# Altium schematic sheet 09 ETHERNET_ENET.SchDoc
size 513 x 386 mm
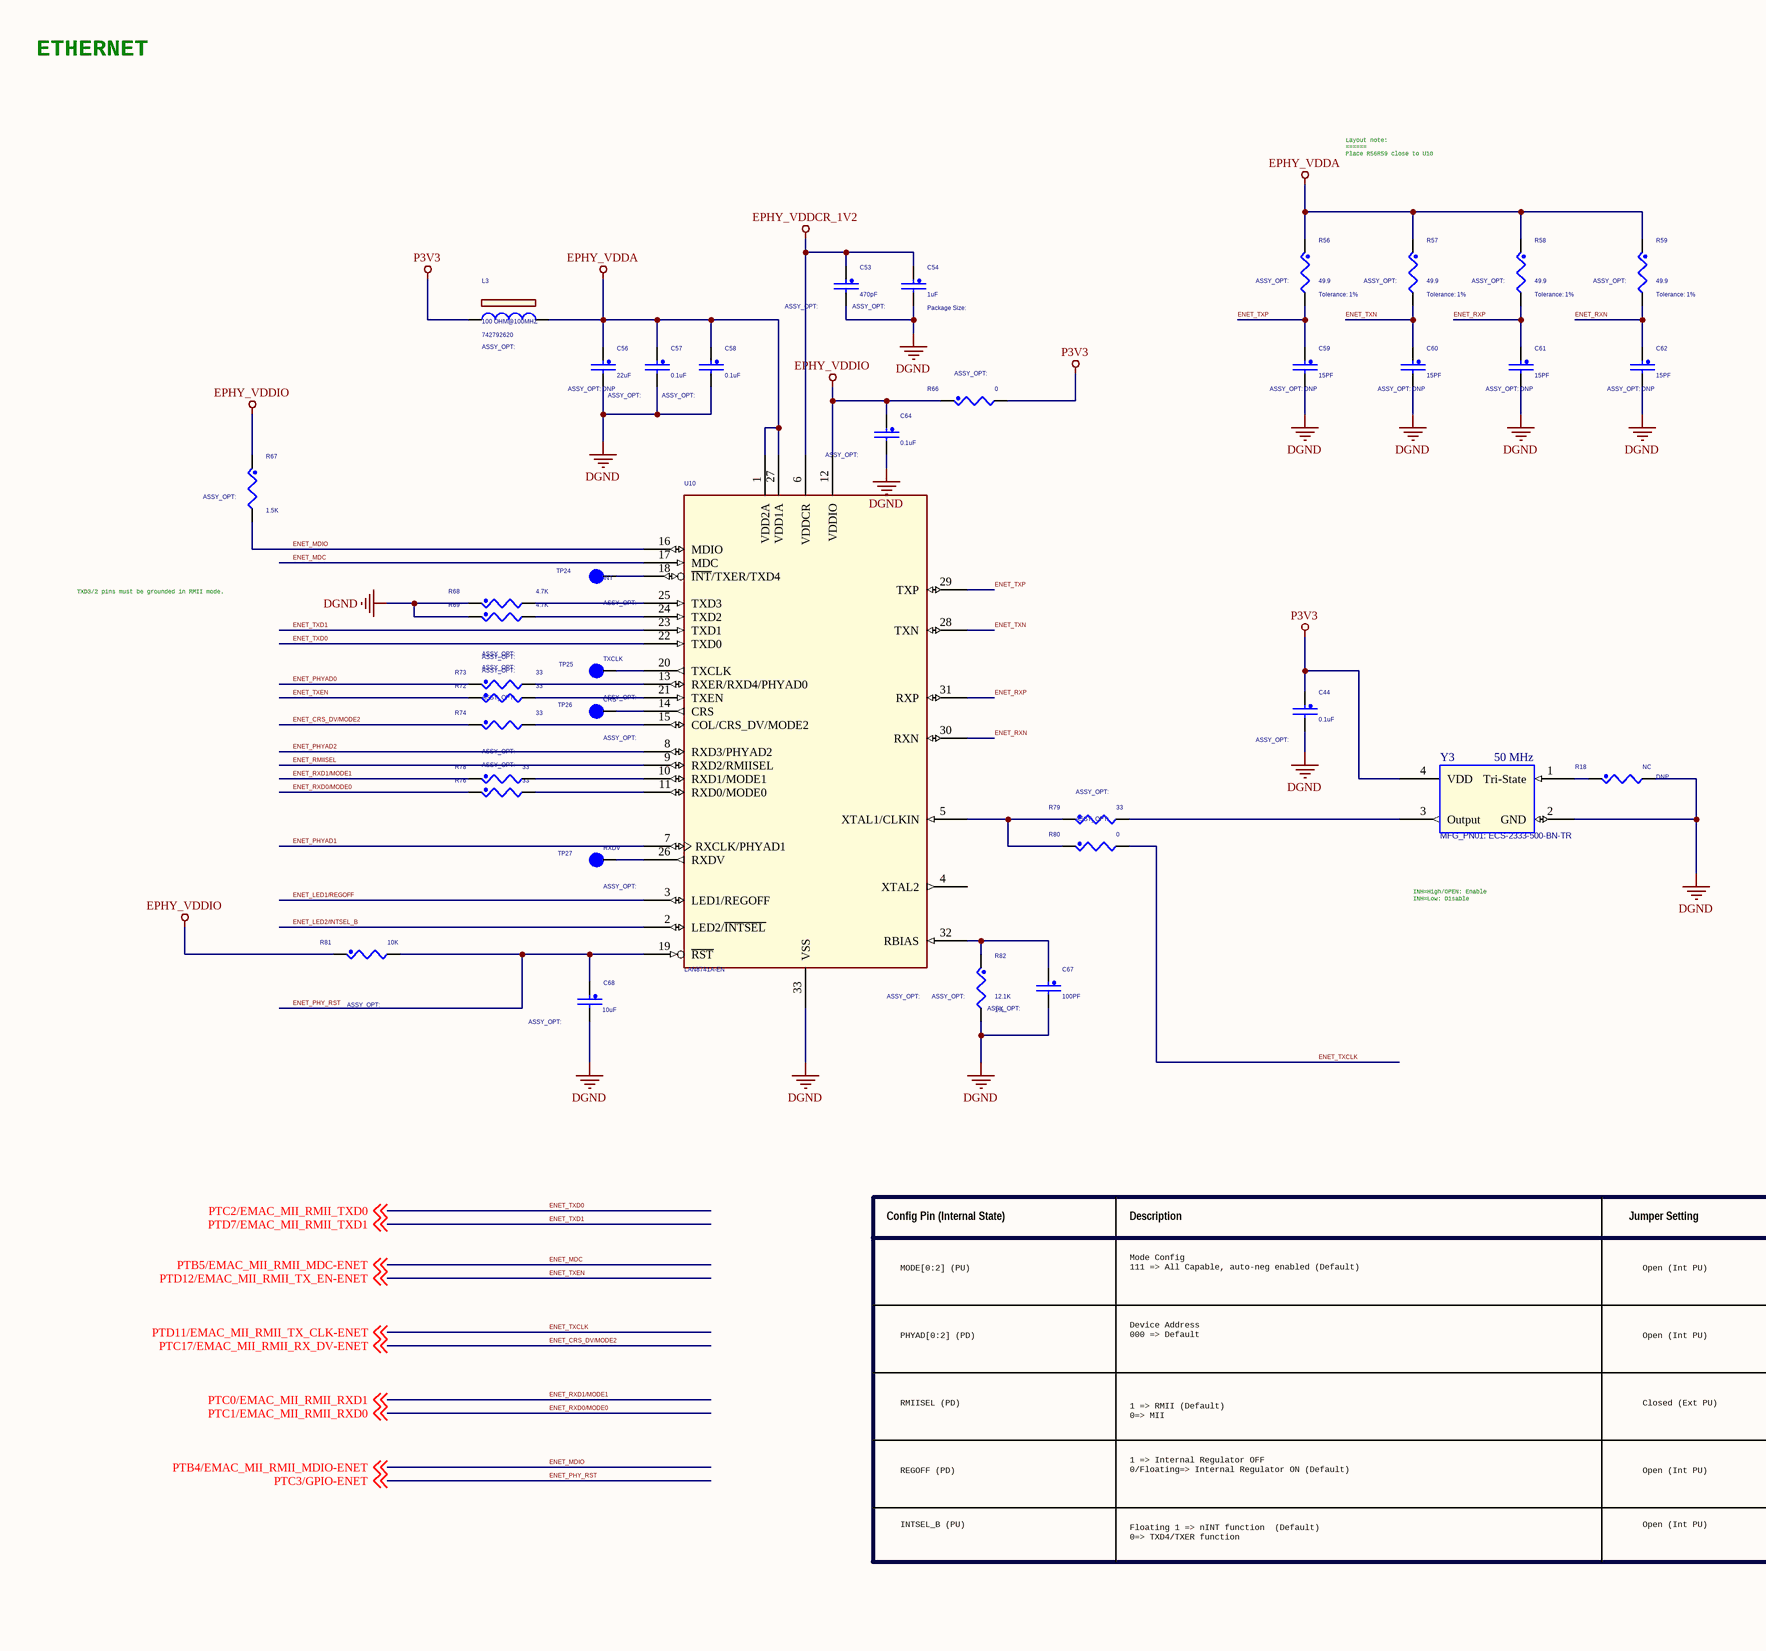
[diagram p0: 09 ETHERNET_ENET.SchDoc, left]
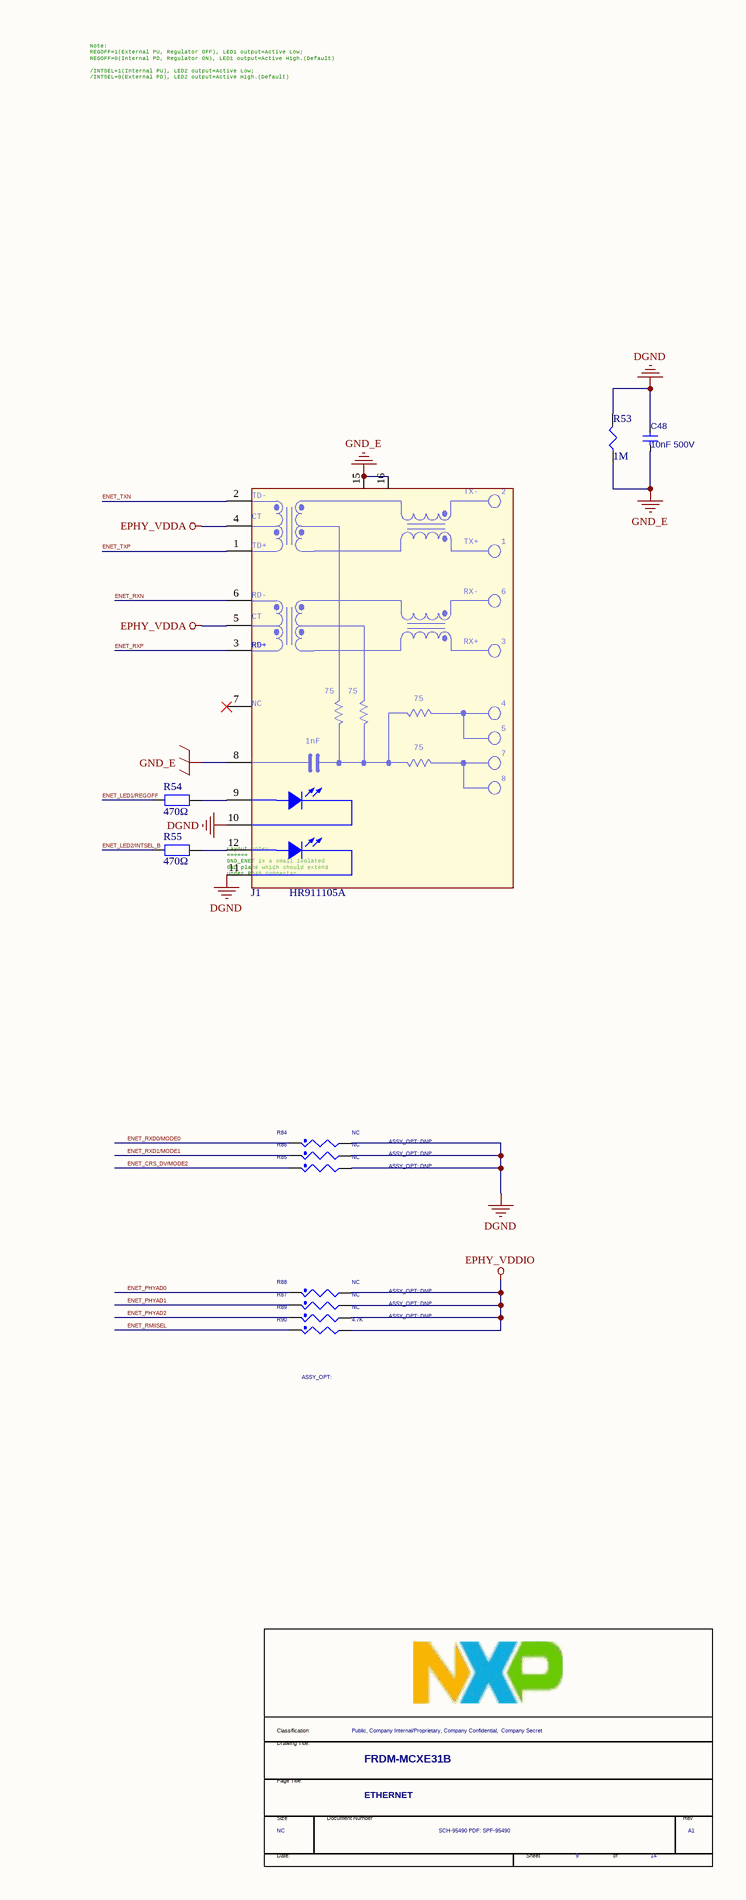
[diagram p1: 09 ETHERNET_ENET.SchDoc, right]

## Parts
*  Title: FRDM-MCXE31B  RevCode: A1  PageTitle: ETHERNET  Page Size: NC  Page Number: 9  Page Count: 14  Doc: SCH-95490 PDF: SPF-95490  Classification: Public, Company Internal/Proprietary, Company Confidential,  Company Secret  (hidden comment: TitleBlock_FS)  (graphical)
C44  0.1uF  [CC0402_25]
C48  10nF 500V  [1210]
C53  470pF  [CC0402_25]
C54  1uF  [CC0402_25]
C56  22uF  ASSY_OPT: DNP  [CC0603_OV]
C57  0.1uF  [CC0402_25]
C58  0.1uF  [CC0402_25]
C59  15PF  ASSY_OPT: DNP  [CC0402_25]
C60  15PF  ASSY_OPT: DNP  [CC0402_25]
C61  15PF  ASSY_OPT: DNP  [CC0402_25]
C62  15PF  ASSY_OPT: DNP  [CC0402_25]
C64  0.1uF  [CC0402_25]
C67  100PF  [CC0402_25]
C68  10uF  [CC0402_25]
J1  HR911105A  [RJ45-HR911105A]
L3  100 OHM@100MHZ  MFG_PN01: 742792620  [L 0603_L]
R18  NC  ASSY_OPT: DNP  [RC0402_25]
R53  1M  [1210]
R54  470Ω  [R0603]
R55  470Ω  [R0603]
R56  49.9  Tolerance: 1%  [RC0402_25]
R57  49.9  Tolerance: 1%  [RC0402_25]
R58  49.9  Tolerance: 1%  [RC0402_25]
R59  49.9  Tolerance: 1%  [RC0402_25]
R66  0  [RC0603_OV]
R67  1.5K  [RC0402_25]
R68  4.7K  [RC0402_25]
R69  4.7K  [RC0402_25]
R72  33  [RC0402_25]
R73  33  [RC0402_25]
R74  33  [RC0402_25]
R76  33  [RC0402_25]
R78  33  [RC0402_25]
R79  33  [RC0402_25]
R80  0  [RC0402_25]
R81  10K  [RC0402_25]
R82  12.1K  Tolerance: 1%  [RC0402_25]
R84  NC  ASSY_OPT: DNP  [RC0402_25]
R85  NC  ASSY_OPT: DNP  [RC0402_25]
R86  NC  ASSY_OPT: DNP  [RC0402_25]
R87  NC  ASSY_OPT: DNP  [RC0402_25]
R88  NC  ASSY_OPT: DNP  [RC0402_25]
R89  NC  ASSY_OPT: DNP  [RC0402_25]
R90  4.7K  [RC0402_25]
TP24  SILK: INT  [TPAD_030]  (hidden comment: TPAD_030)
TP25  SILK: TXCLK  [TPAD_030]  (hidden comment: TPAD_030)
TP26  SILK: CRS  [TPAD_030]  (hidden comment: TPAD_030)
TP27  SILK: RXDV  [TPAD_030]  (hidden comment: TPAD_030)
U10  LAN8741A-EN  [QFN-32-EP(5x5)]
Y3  50 MHz  MFG_PN01: ECS-2333-500-BN-TR  [OSC-SMD_4P-L3.2-W2.5-BL]

## Nets
DGND: C44.2 C48.2 C53.2 C54.2 C56.2 C57.2 C58.2 C59.2 C60.2 C61.2 C62.2 C64.2 C67.2 C68.2 J1.10(CATHODE) J1.11(CATHODE) R18.2 R53.2 R68.1 R69.1 R82.2 R84.2 R85.2 R86.2 U10.33(VSS) Y3.2(GND)
EPHY_VDDA: C56.1 C57.1 C58.1 J1.4(P4) J1.5(P5) L3.2 R56.1 R57.1 R58.1 R59.1 U10.1(VDD2A) U10.27(VDD1A)
EPHY_VDDCR_1V2: C53.1 C54.1 U10.6(VDDCR)
EPHY_VDDIO: C64.1 R66.1 R67.1 R81.1 R87.2 R88.2 R89.2 R90.2 U10.12(VDDIO)
GND_E: C48.1 J1.8(P8) J1.15(P15) J1.16(P16) R53.1
P3V3: C44.1 L3.1 R66.2 Y3.4(VDD)
ENET_CRS_DV/MODE2: R74.1 R85.1 ; off-sheet PTC17/EMAC_MII_RMII_RX_DV-ENET  [also labelled PTC17/EMAC_MII_RMII_RX_DV-ENET]
ENET_LED1/REGOFF: R54.2 U10.3(LED1/REGOFF)
ENET_LED2/INTSEL_B: R55.2 U10.2(LED2/~{INTSEL})
ENET_MDC: U10.17(MDC) ; off-sheet PTB5/EMAC_MII_RMII_MDC-ENET  [also labelled PTB5/EMAC_MII_RMII_MDC-ENET]
ENET_MDIO: R67.2 U10.16(MDIO) ; off-sheet PTB4/EMAC_MII_RMII_MDIO-ENET  [also labelled PTB4/EMAC_MII_RMII_MDIO-ENET]
ENET_PHY_RST: C68.1 R81.2 U10.19(~{RST}) ; off-sheet PTC3/GPIO-ENET  [also labelled PTC3/GPIO-ENET]
ENET_PHYAD0: R73.1 R88.1
ENET_PHYAD1: R87.1 U10.7(RXCLK/PHYAD1)
ENET_PHYAD2: R89.1 U10.8(RXD3/PHYAD2)
ENET_RMIISEL: R90.1 U10.9(RXD2/RMIISEL)
ENET_RXD0/MODE0: R76.1 R84.1 ; off-sheet PTC1/EMAC_MII_RMII_RXD0  [also labelled PTC1/EMAC_MII_RMII_RXD0]
ENET_RXD1/MODE1: R78.1 R86.1 ; off-sheet PTC0/EMAC_MII_RMII_RXD1  [also labelled PTC0/EMAC_MII_RMII_RXD1]
ENET_RXN: C62.1 J1.6(P6) R59.2 U10.30(RXN)
ENET_RXP: C61.1 J1.3(P3) R58.2 U10.31(RXP)
ENET_TXCLK: R80.2 ; off-sheet PTD11/EMAC_MII_RMII_TX_CLK-ENET  [also labelled PTD11/EMAC_MII_RMII_TX_CLK-ENET]
ENET_TXD0: U10.22(TXD0) ; off-sheet PTC2/EMAC_MII_RMII_TXD0  [also labelled PTC2/EMAC_MII_RMII_TXD0]
ENET_TXD1: U10.23(TXD1) ; off-sheet PTD7/EMAC_MII_RMII_TXD1  [also labelled PTD7/EMAC_MII_RMII_TXD1]
ENET_TXEN: R72.1 ; off-sheet PTD12/EMAC_MII_RMII_TX_EN-ENET  [also labelled PTD12/EMAC_MII_RMII_TX_EN-ENET]
ENET_TXN: C60.1 J1.2(P2) R57.2 U10.28(TXN)
ENET_TXP: C59.1 J1.1(P1) R56.2 U10.29(TXP)
NetC67_1: C67.1 R82.1 U10.32(RBIAS)
NetJ1_9: J1.9(ANODE) R54.1
NetJ1_12: J1.12(ANODE) R55.1
NetR18_1: R18.1 Y3.1(Tri-State)
NetR68_2: R68.2 U10.25(TXD3)
NetR69_2: R69.2 U10.24(TXD2)
NetR72_2: R72.2 U10.21(TXEN)
NetR73_2: R73.2 U10.13(RXER/RXD4/PHYAD0)
NetR74_2: R74.2 U10.15(COL/CRS_DV/MODE2)
NetR76_2: R76.2 U10.11(RXD0/MODE0)
NetR78_2: R78.2 U10.10(RXD1/MODE1)
NetR79_1: R79.1 R80.1 U10.5(XTAL1/CLKIN)
NetR79_2: R79.2 Y3.3(Output)
NetTP24_1: TP24.1(Pin1) U10.18(~{INT}/TXER/TXD4)
NetTP25_1: TP25.1(Pin1) U10.20(TXCLK)
NetTP26_1: TP26.1(Pin1) U10.14(CRS)
NetTP27_1: TP27.1(Pin1) U10.26(RXDV)

Not connected (* = marked no-connect by the designer): J1 7(P7)*; U10 4(XTAL2)

## Notes on the sheet
- ETHERNET
- Layout note:
  ======
  Place R56R59 close to U10
- Note:
  REGOFF=1(External PU, Regulator OFF), LED1 output=Active Low;
  REGOFF=0(Internal PD, Regulator ON), LED1 output=Active High.(Default)
  /INTSEL=1(Internal PU), LED2 output=Active Low;
  /INTSEL=0(External PD), LED2 output=Active High.(Default)
- TXD3/2 pins must be grounded in RMII mode.
- INH=High/OPEN: Enable
  INH=Low: Disable
- (near J1) Layout note:
  ======
  GND_ENET is a small isolated
  GND plane which should extend
  under RJ45 connector
- Config Pin (Internal State)
- Description
- Jumper Setting
- MODE[0:2] (PU)
- Mode Config
  111 => All Capable, auto-neg enabled (Default)
- Open (Int PU)
- PHYAD[0:2] (PD)
- Device Address
  000 => Default
- RMIISEL (PD)
- 1 => RMII (Default)
  0=> MII
- Closed (Ext PU)
- REGOFF (PD)
- 1 => Internal Regulator OFF
  0/Floating=> Internal Regulator ON (Default)
- INTSEL_B (PU)
- Floating 1 => nINT function  (Default)
  0=> TXD4/TXER function
- (in symbol HR911105A) TX-; TD-; CT; TX+; TD+; RX-; RD-; RX+; RD+; 75; NC; 1nF
- (in symbol TitleBlock_FS) Classification:; Drawing Title:; Page Title:; Size; Document Number; Rev; Date:; Sheet; of

## Library data of the parts
* = TitleBlock_FS: Variant Name: <Core Design>; OrgAddr2: Austin, TX 78735-8598; OrgAddr1: 6501 William Cannon Drive West; OrgName: NXP Semiconductors; Classification: Company Internal/Proprietary; Page Create Date: March  8, 1995
C44 C57 C58 C64 = CAP_NP: CAP CER 0.1UF 16V 10% X7R 0402; CLASS: DISCRETE; Temp Range: -55C to +125C; SIGNAL_MODEL: DEFAULT_CAPACITOR_100000pF_2_1; AGILE_PN: 150-75182; MFG_NAME01: Samsung Electro-Mechanics; MFG_PN01: CL05B104KO5NNNC; CAD_APPROVED: Yes; FPLIST: CC0402_25,CC0402_HD,0402_CC,CAPC0402_L,cc0402_lamp3; Temp_Range: -55癈 to +85癈; 3D_Mechanical_Footprint_File: http://fcl.am.freescale.net/ALLEGRO/step/cc0402_25.STEP; Rated Voltage: 16V; Tolerance: 10%; ROHS: NULL; HEIGHT: 0.635mm; TOL: 10%; VOLTAGE: 16V
C48 = CAP
C53 = CAP_NP: CAP CER 470pF 50V 5% C0G 0402; CLASS: DISCRETE; AGILE_PN: 150-30004; FPLIST: CC0402_25,CC0402_HD,0402_CC,capc0402_l; CAD_APPROVED: YES; Temp Range: -55C to +125C; MFG_NAME01: MURATA; MFG_PN01: GRM1555C1H471JA01D; Package Size: 0402; HEIGHT: 0.55; Tolerance: 5%; Rated Voltage: 50V; ROHS: NULL
C54 = CAP_NP: CAP CER 1.0uF 16V 10% X6S 0402; CLASS: DISCRETE; MFG_PN01: GRM155C81C105KE11D; MFG_NAME01: MURATA; Temp Range: -55C to +105C; CAD_APPROVED: Yes; FPLIST: CC0402_25,CC0402_HD,0402_CC,capc0402_l; AGILE_PN: 150-80262; VOLTAGE: 16V; ROHS: Yes; Rated Voltage: 16V; Tolerance: 10%; HEIGHT: 0.55
C56 = CAP_NP: CAP CER 22uF 10V 20% X5R 0603; CLASS: DISCRETE; AGILE_PN: 150-79530; FPLIST: CC0603_OV,CC0603,0603_cc_tol; CAD_APPROVED: Yes; Temp Range: -55°C to 85°C; MFG_NAME01: SAMSUNG; MFG_PN01: CL10A226MP7LUNC; Package Size: 0603 [1608 Metric]; HEIGHT: 1.05mm; Package Type: SMD/SMT; Tolerance: 20%; Rated Voltage: 10V; ROHS: NULL; 3D_Mechanical_Footprint_File: http://fcl.am.freescale.net/ALLEGRO/step/cc0603_ov.STEP
C59-C62 = CAP_NP: CAP CER 15pF 50V 5% C0G 0402; CLASS: DISCRETE; AGILE_PN: 150-81667; FPLIST: CC0402_25,CC0402_HD,0402_CC,capc0402_l; CAD_APPROVED: Yes; Temp Range: -55°C ~ 125°C; MFG_NAME01: Murata Electronics; MFG_PN01: GJM1555C1H150JB01D; Package Size: 0402 (1005 Metric); HEIGHT: 0.55; Package Type: Surface Mount, MLCC; Tolerance: 5%; Rated Voltage: 50V; ROHS: Yes; 3D_Mechanical_Footprint_File: http://fcl.am.freescale.net/ALLEGRO/step/cc0402_25.STEP
C67 = CAP_NP: CAP CER 100pF 16V 10% X7R 0402; CLASS: DISCRETE; MFG_PN01: 0402YC101KAT2A; MFG_NAME01: AVX; Temp Range: -55C to +125C; CAD_APPROVED: Yes; FPLIST: CC0402_25,CC0402_HD,0402_CC,capc0402_l; AGILE_PN: 150-79188; ROHS: Yes; Rated Voltage: 16V; Tolerance: 10%; Package Type: 7" Reel; HEIGHT: 0.56; Package Size: 0402
C68 = CAP_NP: CAP CER 10uF 25V 20% X5R 0603; CLASS: DISCRETE; AGILE_PN: 150-79272; CAD_APPROVED: Yes; Temp Range: -55C to +85C; MFG_NAME01: MURATA; MFG_PN01: GRM188R61E106MA73D; FPLIST: CC0603_OV,CC0603,0603_cc_tol; Package Size: 0603; HEIGHT: 1; Tolerance: 20%; Rated Voltage: 25V; ROHS: Yes
J1 = HR911105A: REF: J00-0061NL; DESIG: 10/100 base TX LXT971A; BOI: RJ45; FAB: PULSE; DEV: CON_PULSE_J00-61; RoHS: YES; VAL: J00-0061NL
L3 = INDUCTOR_FERRITE: IND FER BEAD 100 OHM@100MHz 0.5A 25% AEC-Q200 0603; CLASS: DISCRETE; AGILE_PN: 180-10207; CAD_APPROVED: Yes; Temp Range: -55°C to 125°C; MFG_NAME01: WURTH ELEKTRONIK EISOS GMBH & CO. KG (ELECTRONIC & ELECTROMEHANICAL COMP); Package Size: 0603; HEIGHT: 1mm; ROHS: NULL; 3D_Mechanical_Footprint_File: http://fcl.am.freescale.net/ALLEGRO/step/ind_1p8x1mm_sm.step
R18 R80 = RES: RES MF ZERO OHM 1/10W -- 0603; CLASS: DISCRETE; AGILE_PN: 470-80866; FPLIST: RC0603_OV,RC0603,R603-X2,r603-x2_b,0603_CC,IND_0603HP_NSP,CC0603_OV_NSP; CAD_APPROVED: Yes; Temp Range: –55 °C to +155 °C; MFG_NAME01: VISHAY; MFG_PN01: CRCW06030000Z0EAC; HEIGHT: 0.6; ROHS: NULL
R53 = R
R54 R55 = R: 贴片电阻; 版权归属: 源创客; BOM名称: 贴片电阻; 学习资源: www.ooocke.com
R56-R59 = RES: RES MF 49.9 OHM 1/16W 1% 0402; CLASS: DISCRETE; MFG_PN01: CR0402-FX-49R9GLF; MFG_NAME01: BOURNS; CAD_APPROVED: Yes; FPLIST: RC0402_25,RC0402_HD,0402_CC; AGILE_PN: 470-75360; ROHS: Yes; HEIGHT: 0.4
R66 = RES: RES MF ZERO OHM 1/10W -- 0603; CLASS: DISCRETE; MFG_PN01: CRCW06030000Z0EAC; MFG_NAME01: VISHAY; Temp Range: –55 °C to +155 °C; CAD_APPROVED: Yes; FPLIST: RC0603_OV,RC0603,R603-X2,r603-x2_b,0603_CC,IND_0603HP_NSP,CC0603_OV_NSP; AGILE_PN: 470-80866; ROHS: NULL; HEIGHT: 0.6
R67 = RES: RES MF 1.5K 1/16W 1% 0402; CLASS: DISCRETE; MFG_PN01: CR0402-FX-1501GLF; MFG_NAME01: BOURNS; CAD_APPROVED: Yes; FPLIST: RC0402_25,RC0402_HD,0402_CC; AGILE_PN: 470-80487; ROHS: Yes; Tolerance: 1%; HEIGHT: 0.4
R68 R86 R87 R89 = RES: RES MF 4.7K 1/16W 5% 0402; CLASS: DISCRETE; Pkg: 0402; AGILE_PN: 470-75626; FPLIST: RC0402_25,RC0402_HD,0402_CC,RC0402_X2; CAD_APPROVED: Yes; MFG_NAME01: BOURNS; MFG_PN01: CR0402-JW-472GLF; HEIGHT: 0.41; Tolerance: 5%; ROHS: NULL
R69 R84 R85 R88 R90 = RES: RES MF 4.7K 1/16W 5% 0402; CLASS: DISCRETE; MFG_PN01: CR0402-JW-472GLF; MFG_NAME01: BOURNS; CAD_APPROVED: Yes; FPLIST: RC0402_25,RC0402_HD,0402_CC,RC0402_X2; AGILE_PN: 470-75626; Pkg: 0402; ROHS: NULL; Tolerance: 5%; HEIGHT: 0.41
R72 R76 R79 = RES: RES MF 33.0 OHM 1/16W 1% 0402; CLASS: DISCRETE; MFG_PN01: CRCW040233R0FKEDC; MFG_NAME01: VISHAY; CAD_APPROVED: Yes; FPLIST: RC0402_25,RC0402_HD,RC0402_X2,0402_CC; AGILE_PN: 470-75790; ROHS: Yes; Tolerance: 1%; HEIGHT: 0.4
R73 R74 R78 = RES: RES MF 33.0 OHM 1/16W 1% 0402; CLASS: DISCRETE; AGILE_PN: 470-75790; FPLIST: RC0402_25,RC0402_HD,RC0402_X2,0402_CC; CAD_APPROVED: Yes; MFG_NAME01: VISHAY; MFG_PN01: CRCW040233R0FKEDC; HEIGHT: 0.4; Tolerance: 1%; ROHS: Yes
R81 = RES: RES MF 10K 1/16W 5% 0402; CLASS: DISCRETE; MFG_PN01: CR0402-JW-103GLF; MFG_NAME01: BOURNS; CAD_APPROVED: Yes; FPLIST: RC0402_25,RC0402_HD,0402_CC; AGILE_PN: 470-75557; ROHS: NULL; Tolerance: 5%; HEIGHT: 0.4MM
R82 = RES: RES MF 12.1K 1/16W 1% 0402; CLASS: DISCRETE; AGILE_PN: 470-76098; FPLIST: RC0402_25,RC0402_HD,0402_CC; CAD_APPROVED: Yes; MFG_NAME01: BOURNS; MFG_PN01: CR0402-FX-1212GLF; HEIGHT: 0.4; ROHS: Yes
TP24 TP26 = TESTLOOP: TEST POINT PAD 30MIL DIA SMT, NO PART TO ORDER; CLASS: IO; CAD_APPROVED: Yes; MFG_PN01: NOTACOMPONENT; AGILE_PN: 211-76642; HEIGHT: 0.1; ROHS: Yes; MFG_NAME01: NOTACOMPONENT; 3D_Mechanical_Footprint_File: http://fcl.am.freescale.net/ALLEGRO/step/tpad_030.STEP
TP25 TP27 = TESTLOOP: TEST POINT PAD 30MIL DIA SMT, NO PART TO ORDER; CLASS: IO; AGILE_PN: 211-76642; MFG_NAME01: NOTACOMPONENT; CAD_APPROVED: Yes; 3D_Mechanical_Footprint_File: http://fcl.am.freescale.net/ALLEGRO/step/tpad_030.STEP; MFG_PN01: NOTACOMPONENT; ROHS: Yes; HEIGHT: 0.1
U10 = LAN8710: IC XCVR ETHERNET PHY MII/RMII 1.8-3.3V SQFN32; AGILE_PN: 312-83484; CAD_APPROVED: Yes; Temp Range: -0C to +70C; MFG_NAME01: Microchip Technology; CLASS: IC; Package Size: SQFN-32; HEIGHT: 1; Supply Voltage: 1.8-3.3V; ROHS: Yes; MFG_PN01: LAN8741A-EN; 3D_Mechanical_Footprint_File: http://fcl.am.freescale.net/ALLEGRO/step/qfn32ep.STEP
Y3 = OSC_ASFL: OSC XO 50MHZ 3.3V SMD; CLASS: IC; PCB Footprint: osc4_3p2x2p5_sm; MFG_NAME01: ECS INC. INTERNATIONAL; Temp Range: -40  °C + 85 °C; CAD_APPROVED: YES; AGILE_PN: 230-78687; ROHS: YES; HEIGHT: 1; Package Size: 3.2 mm x 2.5 mm